# EAGLE design Adafruit NeoJewel 7 (EAGLE 6.3)
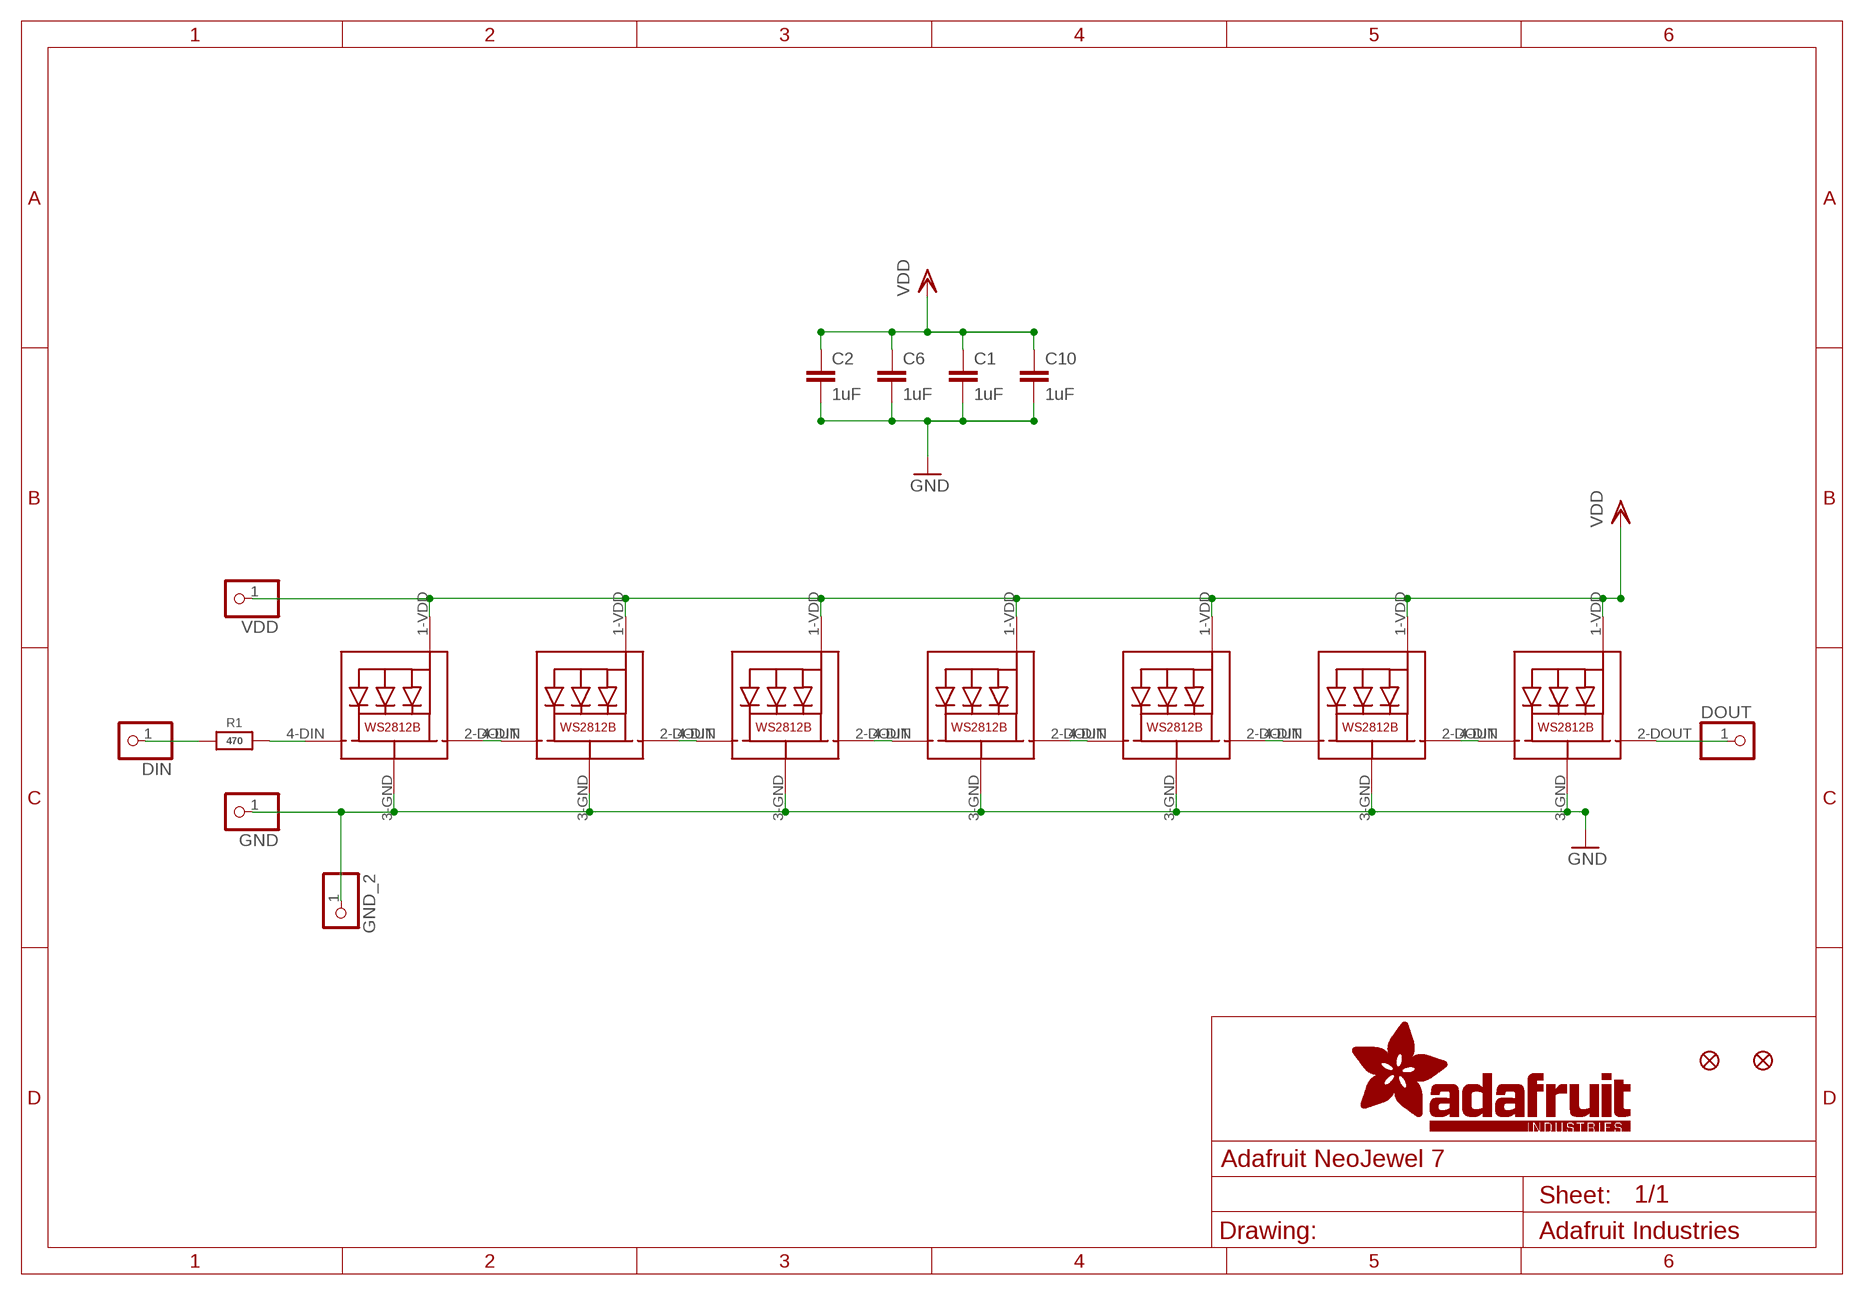
[diagram p0: schematic, sheet 1]

## Parts
C1  1uF  C-EUC0603  [C0603]
C2  1uF  C-EUC0603  [C0603]
C6  1uF  C-EUC0603  [C0603]
C10  1uF  C-EUC0603  [C0603]
DIN  PINHD-1X1CB  [1X01-CLEANBIG]
DOUT  PINHD-1X1CB  [1X01-CLEANBIG]
FID1  FIDUCIAL""  [FIDUCIAL_1MM]
FID2  FIDUCIAL""  [FIDUCIAL_1MM]
GND  PINHD-1X1CB  [1X01-CLEANBIG]
GND_2  PINHD-1X1CB  [1X01-CLEANBIG]
LED1  WS2812B5050  [WS2812B]
LED2  WS2812B5050  [WS2812B]
LED3  WS2812B5050  [WS2812B]
LED4  WS2812B5050  [WS2812B]
LED5  WS2812B5050  [WS2812B]
LED6  WS2812B5050  [WS2812B]
LED7  WS2812B5050  [WS2812B]
R1  470  RESISTOR_0603_NOOUT  [0603-NO]
VDD  PINHD-1X1CB  [1X01-CLEANBIG]

## Nets
GND: C1.2 C2.2 C6.2 C10.2 GND.1 GND_2.1 LED1.3-GND(GND) LED2.3-GND(GND) LED3.3-GND(GND) LED4.3-GND(GND) LED5.3-GND(GND) LED6.3-GND(GND) LED7.3-GND(GND)
N$1: LED1.2-DOUT(DO) LED2.4-DIN(DI)
N$2: LED2.2-DOUT(DO) LED3.4-DIN(DI)
N$3: LED3.2-DOUT(DO) LED4.4-DIN(DI)
N$4: LED4.2-DOUT(DO) LED5.4-DIN(DI)
N$5: LED5.2-DOUT(DO) LED6.4-DIN(DI)
N$6: LED6.2-DOUT(DO) LED7.4-DIN(DI)
N$7: DOUT.1 LED7.2-DOUT(DO)
N$12: LED1.4-DIN(DI) R1.2
N$13: DIN.1 R1.1
VDD: C1.1 C2.1 C6.1 C10.1 LED1.1-VDD(VDD) LED2.1-VDD(VDD) LED3.1-VDD(VDD) LED4.1-VDD(VDD) LED5.1-VDD(VDD) LED6.1-VDD(VDD) LED7.1-VDD(VDD) VDD.1

## Library data of the parts
C1 C2 C6 C10 = rcl:C-EU: CAPACITOR, European symbol
DIN DOUT GND GND_2 VDD = NeoPixelRing:PINHD-1X1: Pin header 1x1 for 0.1" spacing With round pins
FID1 FID2 = microbuilder:FIDUCIAL: Fiducial Alignment Points Various fiducial points for machine vision alignment.; BOM: EXCLUDE
LED1-LED7 = microbuilder:WS2812B5050
R1 = microbuilder:RESISTOR: Resistors For new designs, use the packages preceded by an '_' character since they are more reliable: The following footprints should be used on most boards: _0402 - Standard footprint for regular board layouts _0603 - Standard footprint for regular board layouts _0805 - Standard footprint for regular board layouts _1206 - Standard footprint for regular board layouts For extremely tight-pitch boards where space is at a premium, the following 'micro-pitch' footprints can be used (smaller pads, no silkscreen outline, etc.): _0402MP - Micro-pitch footprint for very dense/compact boards _0603MP - Micro-pitch footprint for very dense/compact boards _0805MP - Micro-pitch footprint for very dense/compact boards _1206MP - Micro-pitch footprint for very dense/compact boards

## Board
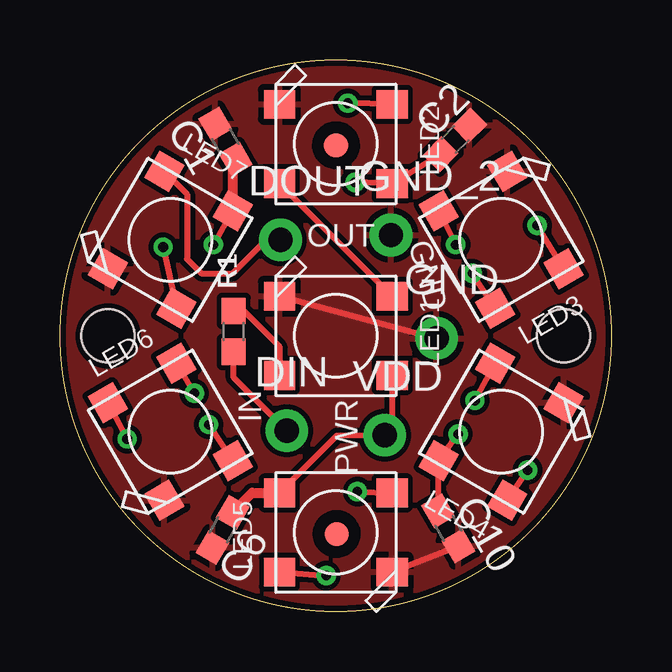
[diagram p1: board, top side]
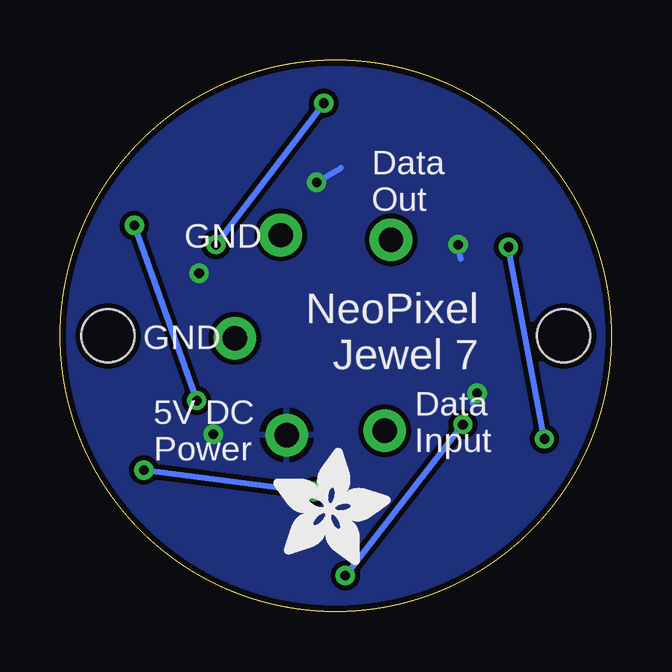
[diagram p2: board, bottom side, seen from below]

Size 23 x 23 mm. Coordinates in mm from the lower left corner, seen from the top.
Outline: circle at 11.5,11.5 radius 11.5
Copper layers (1*16): Top 0.035mm / dielectric 1.5mm / Bottom 0.035mm
Design rules "adafruit": minimum track width 8mil, minimum drill 15.5mil, track to track 8mil, track to pad 8mil, pad to pad 8mil, via to via 8mil, smd to smd 8mil, copper to edge 10mil, drill to drill 8mil, minimum pad ring 10mil, minimum via ring 8mil, stop-mask expansion 4mil, vias tented up to drill 20mil, thermal gap 10mil
Holes 2.2 mm at 21,11.5 2,11.5

### Footprints (pad centres in the part's own frame; a part is rotated, then mirrored left to right if it is on the bottom)
C0603 = smd 1.1 x 1: 1 -0.85,0; 2 0.85,0
1X01-CLEANBIG = drill 1.016 pad 1.778: 1 0,0
FIDUCIAL_1MM = smd 1 x 1: 1 0,0
WS2812B-NARROW = smd 1.3 x 1.2: 1-VDD 2.35,-1.65; 2-DOUT 2.35,1.65; 3-GND -2.35,1.65; 4-DIN -2.35,-1.65
0603-NO = smd 1.1 x 1: 1 -0.85,0; 2 0.85,0

### Placement (x,y rotation side)
C1  6.9,19.6 120 top
C2  16.47,19.67 45 top
C6  6.78,3.41 240 top
C10  16.19,3.47 300 top
DIN  9.46,7.54 0 top
DOUT  9.2,15.5 0 top
FID1  11.51,19.45 0 top
FID2  11.54,3.24 0 top
GND  15.71,11.39 0 top
GND_2  13.8,15.7 0 top
LED1  WS2812B5050  [WS2812B-NARROW]  11.5,11.5 0 top
LED2  WS2812B5050  [WS2812B-NARROW]  11.5,19.5 0 top
LED3  WS2812B5050  [WS2812B-NARROW]  18.4,15.5 300 top
LED4  WS2812B5050  [WS2812B-NARROW]  18.4,7.5 240 top
LED5  WS2812B5050  [WS2812B-NARROW]  11.5,3.3 180 top
LED6  WS2812B5050  [WS2812B-NARROW]  4.6,7.5 120 top
LED7  WS2812B5050  [WS2812B-NARROW]  4.6,15.5 60 top
R1  7.25,11.68 90 top
U$3  [ADAFRUIT_5MM]  14.1,1.95 0 bottom
VDD  13.54,7.36 0 top

### Tracks (layer width: path | path; a pad name or v marks a point on that pad's centre or on a via)
GND
  Top 0.254: LED5.3-GND C10.2 | LED1.3-GND GND.1
  pour Top: -0.5,-0.5 23.5,-0.5 23.5,23.5 -0.5,23.5
N$1
  Top 0.254: LED2.4-DIN LED1.2-DOUT
N$2  (via drill 0.4)
  Top 0.254: LED2.2-DOUT v12,21.2 | v16.5,15.3 LED3.4-DIN
  Bottom 0.254: v12,21.2 v16.5,15.3
N$3  (via drill 0.4)
  Top 0.254: LED3.2-DOUT v19.9,16.1 | v17.3,8.8 LED4.4-DIN
  Bottom 0.254: v19.9,16.1 v17.3,8.8
N$4  (via drill 0.4)
  Top 0.254: LED4.2-DOUT v19.5,5.9 | v12.4,5 LED5.4-DIN
  Bottom 0.254: v19.5,5.9 v12.4,5
N$5  (via drill 0.4)
  Top 0.254: LED5.2-DOUT v11.1,1.5 | v6.2,7.8 LED6.4-DIN
  Bottom 0.254: v11.1,1.5 v6.2,7.8
N$6  (via drill 0.4)
  Top 0.254: LED6.2-DOUT v2.8,7.2 | v4.3,15.2 LED7.4-DIN
  Bottom 0.254: v2.8,7.2 v4.3,15.2
N$7
  Top 0.254: LED7.2-DOUT 5.3,17.41 5.3,14.7 5.9,14.1 7.2,14.1 8.8,15.7 DOUT.1
N$12
  Top 0.254: R1.2 7.67,12.53 9.15,11.05 LED1.4-DIN
N$13
  Top 0.254: DIN.1 7.25,9.75 R1.1
VDD  (via drill 0.4)
  Top 0.254: C10.1 LED4.1-VDD v16.6,7.4 | C2.1 LED2.1-VDD v12.3,17.9 | LED7.1-VDD v6.4,15.3 | LED3.1-VDD v17.2,14.1 | LED5.1-VDD 11.54,7.34 VDD.1 13.84,7.74 LED1.1-VDD | LED6.1-VDD v5.6,9.1
  Top 0.406: C6.1 8.01,4.95 LED5.1-VDD | C1.1 7.2,18.74 LED7.1-VDD
  Bottom 0.254: v6.4,15.3 6.3,14.7 | v12.3,17.9 11.3,18.5 | v17.2,14.1 17,14.2 | v16.6,7.4 16.8,7.6 | v5.6,9.1 5.8,8.7
  pour Bottom: -0.5,23.5 -0.5,-0.5 23.5,-0.5 23.5,23.5

### Text on the board
tPlace: OUT | GND | PWR | IN
bPlace: Data / Out | GND | NeoPixel / Jewel 7 | GND | Data / Input | 5V DC / Power